# Altium schematic sheet UWB.SchDoc
size A; DocumentNumber: 10; SheetNumber: 10
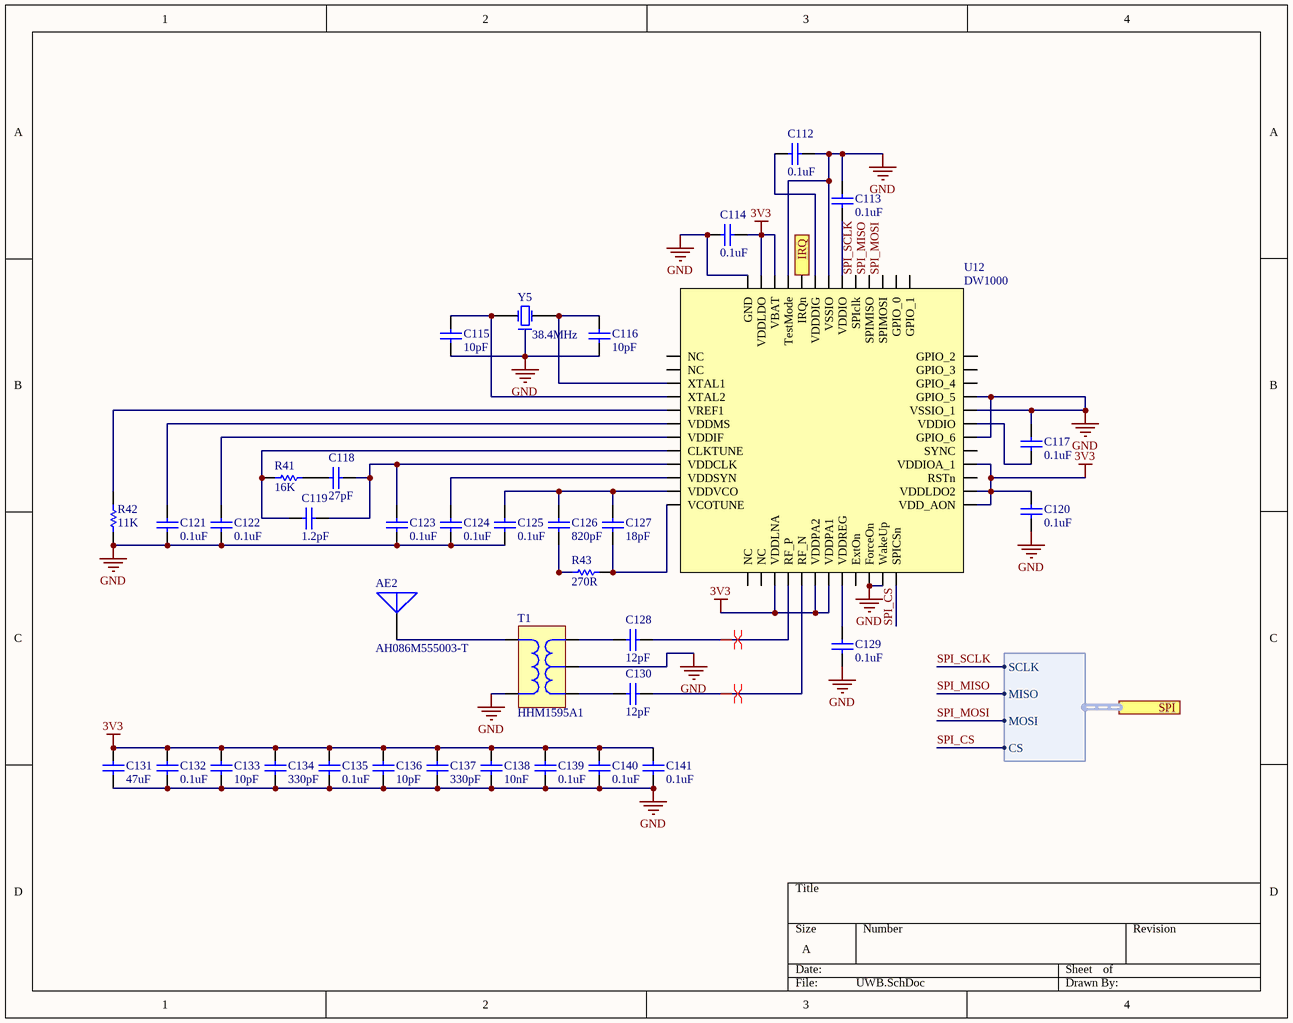
[diagram p0: UWB.SchDoc]

## Parts
AE2  AH086M555003-T  [AH086M555003-T]
C112  value 0.1uF  [C0402[1005X55]]  (hidden comment: 0.1uF 6.3V 0402)
C113  value 0.1uF  [C0402[1005X55]]  (hidden comment: 0.1uF 6.3V 0402)
C114  value 0.1uF  [C0402[1005X55]]  (hidden comment: 0.1uF 6.3V 0402)
C115  value 10pF  [C0402[1005X55]]  (hidden comment: 10pF 50V 0402)
C116  value 10pF  [C0402[1005X55]]  (hidden comment: 10pF 50V 0402)
C117  value 0.1uF  [C0402[1005X55]]  (hidden comment: 0.1uF 6.3V 0402)
C118  value 27pF  [C0402[1005X55]]  (hidden comment: 27pF 50V 0402)
C119  value 1.2pF  [C0402[1005X55]]  (hidden comment: 1.2pF 50V 0402)
C120  value 0.1uF  [C0402[1005X55]]  (hidden comment: 0.1uF 6.3V 0402)
C121  value 0.1uF  [C0402[1005X55]]  (hidden comment: 0.1uF 6.3V 0402)
C122  value 0.1uF  [C0402[1005X55]]  (hidden comment: 0.1uF 6.3V 0402)
C123  value 0.1uF  [C0402[1005X55]]  (hidden comment: 0.1uF 6.3V 0402)
C124  value 0.1uF  [C0402[1005X55]]  (hidden comment: 0.1uF 6.3V 0402)
C125  value 0.1uF  [C0402[1005X55]]  (hidden comment: 0.1uF 6.3V 0402)
C126  value 820pF  [C0402[1005X55]]  (hidden comment: 820pF 50V 0402)
C127  value 18pF  [C0402[1005X55]]  (hidden comment: 18pF 50V 0402)
C128  value 12pF  [C0402[1005X55]]  (hidden comment: 12pF 50V 0402)
C129  value 0.1uF  [C0402[1005X55]]  (hidden comment: 0.1uF 6.3V 0402)
C130  value 12pF  [C0402[1005X55]]  (hidden comment: 12pF 50V 0402)
C131  value 47uF  [C1206[3216X160]]  (hidden comment: 47uF 6.3V 1206)
C132  value 0.1uF  [C0402[1005X55]]  (hidden comment: 0.1uF 6.3V 0402)
C133  value 10pF  [C0402[1005X55]]  (hidden comment: 10pF 50V 0402)
C134  value 330pF  [C0402[1005X55]]  (hidden comment: 330pF 50V 0402)
C135  value 0.1uF  [C0402[1005X55]]  (hidden comment: 0.1uF 6.3V 0402)
C136  value 10pF  [C0402[1005X55]]  (hidden comment: 10pF 50V 0402)
C137  value 330pF  [C0402[1005X55]]  (hidden comment: 330pF 50V 0402)
C138  value 10nF  [C0402[1005X55]]  (hidden comment: 10nF 50V 0402)
C139  value 0.1uF  [C0402[1005X55]]  (hidden comment: 0.1uF 6.3V 0402)
C140  value 0.1uF  [C0402[1005X55]]  (hidden comment: 0.1uF 6.3V 0402)
C141  value 0.1uF  [C0402[1005X55]]  (hidden comment: 0.1uF 6.3V 0402)
R41  value 16K  [R0402[1005]]  (hidden comment: 16K 1% 0402)
R42  value 11K  [R0402[1005]]  (hidden comment: 11K 1% 0402)
R43  value 270R  [R0402[1005]]  (hidden comment: 270R 1% 0402)
T1  HHM1595A1  [HHM1595A1]
U12  DW1000  [QFN-48]
Y5  38.4MHz  [ABRA-ABM10]

## Ports
IRQ (out), SPI (harness SPI)

## Harnesses
SPI: SCLK, MISO, MOSI, CS

## Nets
3V3: C114.1 C120.2 C131.2 C132.2 C133.2 C134.2 C135.2 C136.2 C137.2 C138.2 C139.2 C140.2 C141.2 U12.15(VDDLNA) U12.18(VDDPA2) U12.19(VDDPA1) U12.25(VDD_AON) U12.26(VDDLDO2) U12.28(VDDIOA_1) U12.47(VBAT) U12.48(VDDLDO)
GND: C112.1 C113.2 C114.2 C115.1 C116.1 C117.2 C120.1 C121.1 C122.1 C123.1 C124.1 C125.1 C129.1 C131.1 C132.1 C133.1 C134.1 C135.1 C136.1 C137.1 C138.1 C139.1 C140.1 C141.1 R42.1 T1.2 T1.5 U12.22(ForceOn) U12.23(WakeUp) U12.30(GPIO_6) U12.32(VSSIO_1) U12.33(GPIO_5) U12.43(VSSIO) U12.46(TestMode) U12.49(GND) Y5.2
IRQ: U12.45(IRQn) ; port IRQ
SPI_CS: U12.24(SPICSn) ; port SPI.CS
SPI_MISO: U12.40(SPIMISO) ; port SPI.MISO
SPI_MOSI: U12.39(SPIMOSI) ; port SPI.MOSI
SPI_SCLK: U12.41(SPIclk) ; port SPI.SCLK
NetAE2_1: AE2.1 T1.1
NetC112_2: C112.2 U12.44(VDDDIG)
NetC113_1: C113.1 U12.42(VDDIO)
NetC115_2: C115.2 U12.4(XTAL2) Y5.1(X1)
NetC116_2: C116.2 U12.3(XTAL1) Y5.3(X2)
NetC117_1: C117.1 U12.31(VDDIO)
NetC118_1: C118.1 C119.1 C123.2 U12.9(VDDCLK)
NetC118_2: C118.2 R41.1
NetC119_2: C119.2 R41.2 U12.8(CLKTUNE)
NetC121_2: C121.2 U12.6(VDDMS)
NetC122_2: C122.2 U12.7(VDDIF)
NetC124_2: C124.2 U12.10(VDDSYN)
NetC125_2: C125.2 C126.2 C127.2 U12.11(VDDVCO)
NetC126_1: C126.1 R43.1
NetC127_1: C127.1 R43.2 U12.12(VCOTUNE)
NetC128_1: C128.1 T1.4
NetC128_2: C128.2 U12.16(RF_P)
NetC129_2: C129.2 U12.20(VDDREG)
NetC130_1: C130.1 T1.3
NetC130_2: C130.2 U12.17(RF_N)
NetR42_2: R42.2 U12.5(VREF1)

Not connected (* = marked no-connect by the designer): U12 1(NC) 2(NC) 13(NC) 14(NC) 21(ExtOn) 27(RSTn) 29(SYNC) 34(GPIO_4) 35(GPIO_3) 36(GPIO_2) 37(GPIO_1) 38(GPIO_0)

## Layout directives
differential pair: NetC128_2, NetC130_2

## Library data of the parts
AE2 = AH086M555003-T: Manufacturer: Taiyo Yuden; PartNumber: AH086M555003-T; Mounting Technology: Surface Mount
C112-C114 C117 C120-C125 C129 C132 C135 C139-C141 = CAP_0.1uF_6.3V_0402_10%: 0.1uF 6.3V 10% 0402 (1005 Metric); PartNumber: GRM155R70J104KA01D; Manufacturer: Murata; Mounting Technology: Surface Mount; PackageReference: 0402; PackageDescription: 0402 (1005 Metric); Voltage: 6.3V; Tolerance: 10%
C115 C116 C133 C136 = CAP_10pF_50V_0402_1%: 10pF 50V 1% 0402 (1005 Metric); PartNumber: GRM1555C1H100FA01D; Manufacturer: Murata; Mounting Technology: Surface Mount; PackageReference: 0402; PackageDescription: 0402 (1005 Metric); Voltage: 50V; Tolerance: 1%
C118 = CAP_27pF_50V_0402_1%: 27pF 50V 1% 0402 (1005 Metric); PartNumber: GRM1555C1H270FA01D; Manufacturer: Murata; Mounting Technology: Surface Mount; PackageReference: 0402; PackageDescription: 0402 (1005 Metric); Voltage: 50V; Tolerance: 1%
C119 = CAP_1.2pF_50V_0402_0.05pF: 1.2pF 50V 0.05pF 0402 (1005 Metric); PartNumber: GRM1555C1H1R2WA01D; Manufacturer: Murata; Mounting Technology: Surface Mount; PackageReference: 0402; PackageDescription: 0402 (1005 Metric); Voltage: 50V; Tolerance: 0.05pF
C126 = CAP_820pF_50V_0402_5%: 820pF 50V 5% 0402 (1005 Metric); PartNumber: GRM1555C1H821JA01D; Manufacturer: Murata; Mounting Technology: Surface Mount; PackageReference: 0402; PackageDescription: 0402 (1005 Metric); Voltage: 50V; Tolerance: 5%
C127 = CAP_18pF_50V_0402_1%: 18pF 50V 1% 0402 (1005 Metric); PartNumber: GRM1555C1H180FA01D; Manufacturer: Murata; Mounting Technology: Surface Mount; PackageReference: 0402; PackageDescription: 0402 (1005 Metric); Voltage: 50V; Tolerance: 1%
C128 C130 = CAP_12pF_50V_0402_5%: 12pF 50V 5% 0402 (1005 Metric); PartNumber: GRM1555C1H120JA01D; Manufacturer: Murata; Mounting Technology: Surface Mount; PackageReference: 0402; PackageDescription: 0402 (1005 Metric); Voltage: 50V; Tolerance: 5%
C131 = CAP_47uF_6.3V_1206_10%: 47uF 6.3V 10% 1206 (3216 Metric); PartNumber: GRM31CR60J476KE19L; Manufacturer: Murata; Mounting Technology: Surface Mount; PackageReference: 1206; PackageDescription: 1206 (3216 Metric); Voltage: 6.3V; Tolerance: 10%
C134 C137 = CAP_330pF_50V_0402_5%: 330pF 50V 5% 0402 (1005 Metric); PartNumber: GRM1555C1H331JA01D; Manufacturer: Murata; Mounting Technology: Surface Mount; PackageReference: 0402; PackageDescription: 0402 (1005 Metric); Voltage: 50V; Tolerance: 5%
C138 = CAP_10nF_50V_0402_10%: 10nF 50V 10% 0402 (1005 Metric); PartNumber: GCM155R71H103KA55D; Manufacturer: Murata; Mounting Technology: Surface Mount; PackageReference: 0402; PackageDescription: 0402 (1005 Metric); Voltage: 50V; Tolerance: 10%
R41 = RES_16K_0402_1%: 16K 0.063W 1% 0402 (1005 Metric); Manufacturer: KOA Speer; PartNumber: RK73H1ETTP1602F; Tolerance: 1%; Power: 0.063W; Mounting Technology: Surface Mount; PackageReference: 0402; PackageDescription: 0402 (1005 Metric); ComponentLink1Description: Datasheet; ComponentLink1URL: http://www.koaspeer.com/catimages/Products/RK73H/RK73H.pdf
R42 = RES_11K_0402_1%: 11K 0.063W 1% 0402 (1005 Metric); Manufacturer: KOA Speer; PartNumber: RK73H1ETTP1102F; Tolerance: 1%; Power: 0.063W; Mounting Technology: Surface Mount; PackageReference: 0402; PackageDescription: 0402 (1005 Metric); ComponentLink1Description: Datasheet; ComponentLink1URL: http://www.koaspeer.com/catimages/Products/RK73H/RK73H.pdf
R43 = RES_270R_0402_1%: 270R 0.063W 1% 0402 (1005 Metric); Manufacturer: KOA Speer; PartNumber: RK73H1ETTP2700F; Tolerance: 1%; Power: 0.063W; Mounting Technology: Surface Mount; PackageReference: 0402; PackageDescription: 0402 (1005 Metric); ComponentLink1Description: Datasheet; ComponentLink1URL: http://www.koaspeer.com/catimages/Products/RK73H/RK73H.pdf
T1 = HHM1595A1: Manufacturer: TDK; PartNumber: HHM1595A1; PackageReference: 0805; Mounting Technology: Surface Mount
U12 = DW1000: UWB DW1000; PartNumber: DW1000-I-TR13; Manufacturer: Decawave Limited; PackageReference: QFN-48; Mounting Technology: Surface Mount
Y5 = ABM10-165-38.400MHZ-T3: Manufacturer: ABRACON; PartNumber: ABM10-165-38.400MHZ-T3; Mounting Technology: Surface Mount; PackageReference: 4-SMD; PackageDescription: 4-SMD, No Lead (DFN, LCC)